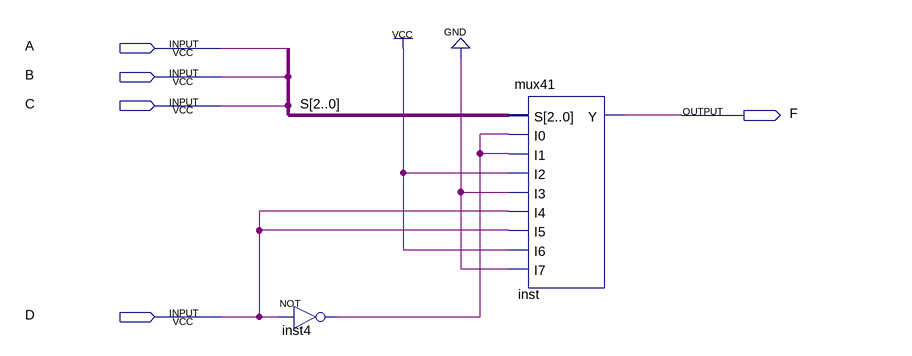
[diagram p0: schematic sheet]
// Quartus schematic Block2.bdf as structural Verilog: 2 symbols, 5 pins
module Block2 (
  input  A,
  input  B,
  input  C,
  input  D,
  output F
);

  wire inst4_out;
  wire [2:0] S;

  not inst4 (inst4_out, D);
  mux41 inst (.S(S), .I0(inst4_out), .I1(inst4_out), .I2(1'b1), .I3(1'b0), .I4(D), .I5(D), .I6(1'b1), .I7(1'b0), .Y(F));
endmodule
